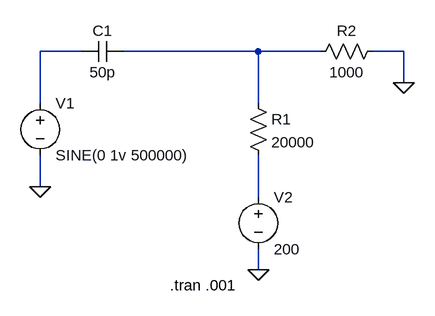
[diagram p0: schematic try1.asc]
try1.asc, the LTspice schematic file:
Version 4
SHEET 1 880 680
WIRE 80 0 16 0
WIRE 352 0 144 0
WIRE 448 0 352 0
WIRE 576 0 528 0
WIRE 576 48 576 0
WIRE 16 80 16 0
WIRE 352 80 352 0
WIRE 16 208 16 160
WIRE 352 224 352 160
WIRE 352 336 352 304
FLAG 16 208 0
FLAG 352 336 0
FLAG 576 48 0
SYMBOL voltage 16 64 R0
WINDOW 123 0 0 Left 0
WINDOW 39 0 0 Left 0
SYMATTR InstName V1
SYMATTR Value SINE(0 1v 500000)
SYMBOL voltage 352 208 R0
WINDOW 123 0 0 Left 0
WINDOW 39 0 0 Left 0
SYMATTR InstName V2
SYMATTR Value 200
SYMBOL cap 144 -16 R90
WINDOW 0 0 32 VBottom 2
WINDOW 3 32 32 VTop 2
SYMATTR InstName C1
SYMATTR Value 50p
SYMBOL res 336 64 R0
SYMATTR InstName R1
SYMATTR Value 20000
SYMBOL res 544 -16 R90
WINDOW 0 0 56 VBottom 2
WINDOW 3 32 56 VTop 2
SYMATTR InstName R2
SYMATTR Value 1000
TEXT 216 360 Left 2 !.tran .001

The netlist it stands for:
* try1.asc
V1 N001 0 SINE(0 1v 500000)
V2 N003 0 200
C1 N002 N001 50p
R1 N002 N003 20000
R2 0 N002 1000
.tran .001
.backanno
.end